# Altium schematic sheet Simple Sensor Board.SchDoc
size A4; SheetNumber: 1; SheetTotal: 1
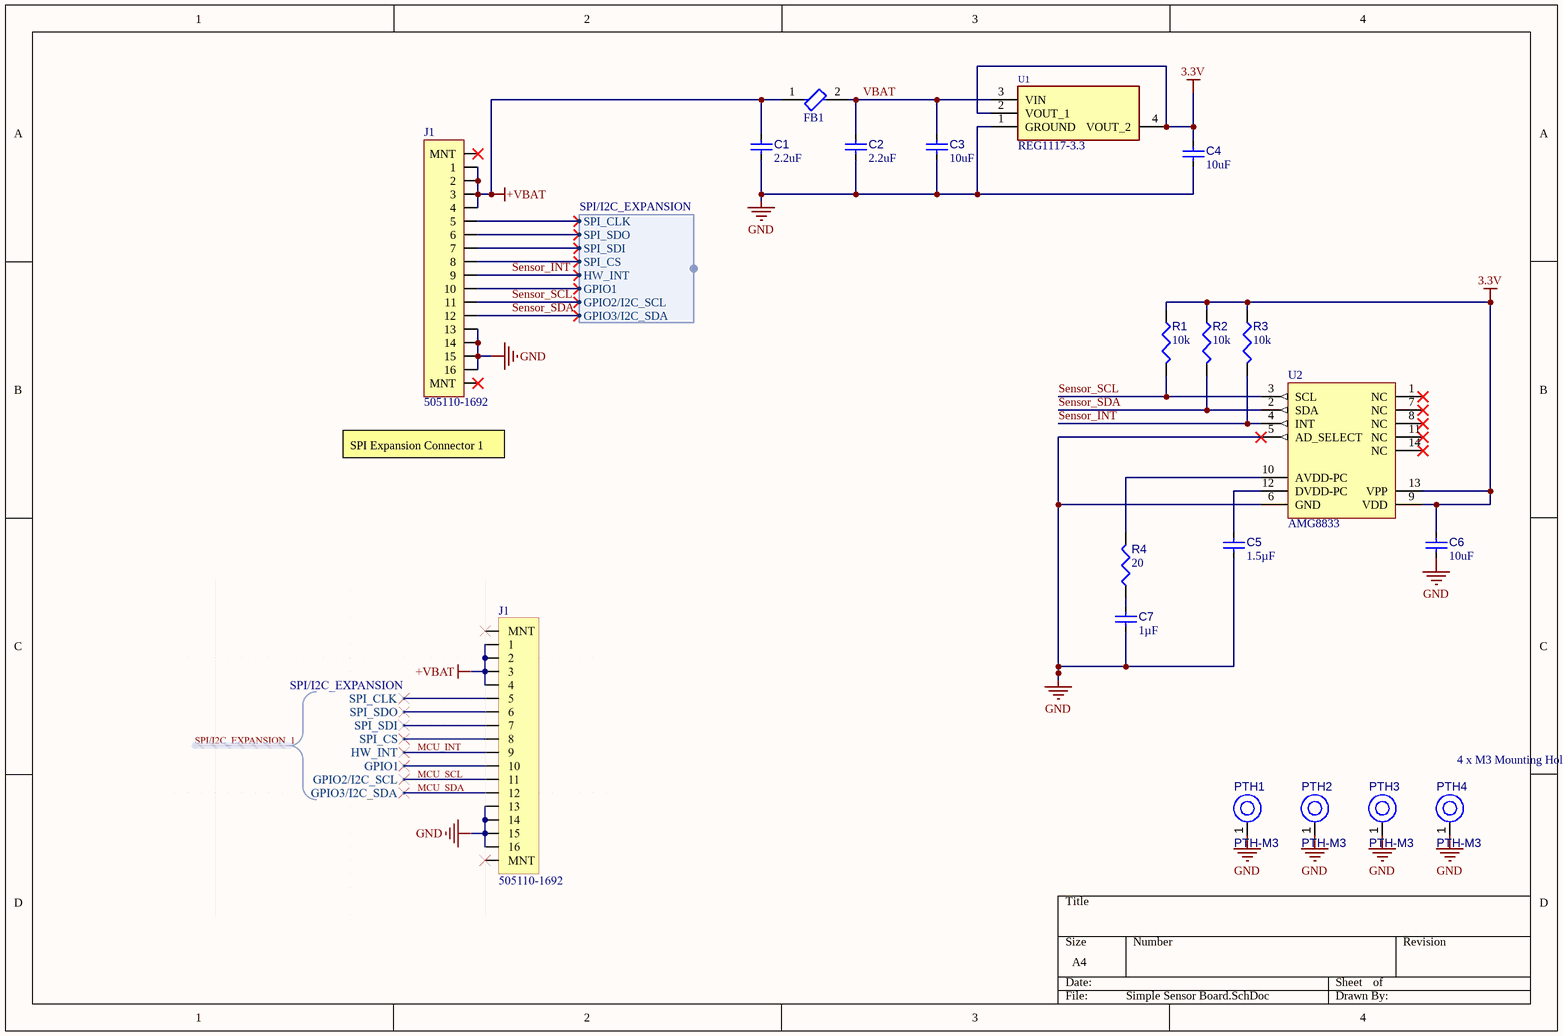
[diagram p0: Simple Sensor Board.SchDoc]

## Parts
C1  value 2.2uF  [CAPC2013X95X50ML10T25]  (hidden comment: Capacitor 2.2 uF +/-10% 16 V 0805)
C2  value 2.2uF  [CAPC2013X95X50ML10T25]  (hidden comment: Capacitor 2.2 uF +/-10% 16 V 0805)
C3  value 10uF  [CAPC3216X180X50ML20T25]  (hidden comment: Capacitor 10 uF +/- 10% 10 V 1206)
C4  value 10uF  [CAPC3216X180X50ML20T25]  (hidden comment: Capacitor 10 uF +/- 10% 10 V 1206)
C5  value 1.5µF  [CAPC1608X90X40ML10T20]  (hidden comment: Capacitor 1.5 uF +/- 10% 25 V 0603)
C6  value 10uF  [CAPC3216X180X50ML20T25]  (hidden comment: Capacitor 10 uF +/- 10% 10 V 1206)
C7  value 1µF  [CAPC1608X90X40ML10T20]  (hidden comment: Capacitor 1 uF +/- 10% 25 V 0603)
FB1  BLM15AX601SZ1D  [FP-BLM15-0_05-IPC_A]  (value not drawn)
J1  505110-1692  [FP-505110-1692-MFG]
PTH1  PTH-M3  [PTH-M3]
PTH2  PTH-M3  [PTH-M3]
PTH3  PTH-M3  [PTH-M3]
PTH4  PTH-M3  [PTH-M3]
R1  value 10k  [RESC1608X55X25ML10T15]  (hidden comment: Resistor 10k +/-1% 0603 100 mW)
R2  value 10k  [RESC1608X55X25ML10T15]  (hidden comment: Resistor 10k +/-1% 0603 100 mW)
R3  value 10k  [RESC1608X55X25ML10T15]  (hidden comment: Resistor 10k +/-1% 0603 100 mW)
R4  value 20  [RESC1608X55X25ML10T15]  (hidden comment: Resistor 20 +/-1% 0603 100 mW)
U1  REG1117-3.3  [SOT230P700X180-4N]
U2  AMG8833  [PNSC-AMG8833_V]

## Harnesses
SPI/I2C_EXPANSION: SPI_CLK, SPI_SDO, SPI_SDI, SPI_CS, HW_INT, GPIO1, GPIO2/I2C_SCL, GPIO3/I2C_SDA

## Nets
3.3V: C4.2 C6.2 R1.1 R2.1 R3.1 U1.2(VOUT_1) U1.4(VOUT_2) U2.9(VDD) U2.13(VPP)
+VBAT: C1.2 FB1.1 J1.1 J1.2 J1.3 J1.4
GND: C1.1 C2.1 C3.1 C4.1 C5.1 C6.1 C7.1 J1.13 J1.14 J1.15 J1.16 PTH1.1(H1) PTH2.1(H1) PTH3.1(H1) PTH4.1(H1) U1.1(GROUND) U2.5(AD_SELECT) U2.6(GND)
Sensor_INT: J1.9 R3.2 U2.4(INT) ; harness SPI/I2C_EXPANSION.HW_INT
Sensor_SCL: J1.11 R1.2 U2.3(SCL) ; harness SPI/I2C_EXPANSION.GPIO2/I2C_SCL
Sensor_SDA: J1.12 R2.2 U2.2(SDA) ; harness SPI/I2C_EXPANSION.GPIO3/I2C_SDA
VBAT: C2.2 C3.2 FB1.2 U1.3(VIN)
NetC5_2: C5.2 U2.12(DVDD-PC)
NetC7_2: C7.2 R4.1
NetJ1_5: J1.5 ; harness SPI/I2C_EXPANSION.SPI_CLK
NetJ1_6: J1.6 ; harness SPI/I2C_EXPANSION.SPI_SDO
NetJ1_7: J1.7 ; harness SPI/I2C_EXPANSION.SPI_SDI
NetJ1_8: J1.8 ; harness SPI/I2C_EXPANSION.SPI_CS
NetJ1_10: J1.10 ; harness SPI/I2C_EXPANSION.GPIO1
NetR4_2: R4.2 U2.10(AVDD-PC)

Not connected (* = marked no-connect by the designer): J1 17(MNT)* 18(MNT)*; U2 1(NC)* 7(NC)* 8(NC)* 11(NC)* 14(NC)*

## Notes on the sheet
- (near J1) SPI Expansion Connector 1
- 4 x M3 Mounting Holes, 32.5x32.5 mm Pattern

## Library data of the parts
C1 C2 = CMP-001-00083-3: Chip Capacitor, 2.2 uF, +/- 10%, 16 V, 0805 (2012 Metric); Voltage Rating: 16V; Capacitor Type: Ceramic; Mounting Technology: SM; Tolerance: 10%; Case/Package: 0805; Min Operating Temperature: -55°C; RoHS Compliant: Yes; Max Operating Temperature: 125°C; Pins: 2
C3 C4 C6 = CMP-001-00086-2: Chip Capacitor, 10 uF, +/- 10%, 10 V, 1206 (3216 Metric); Voltage Rating: 10V; Capacitor Type: Ceramic; Mounting Technology: SM; RoHS Compliant: Yes; Min Operating Temperature: -55°C; Case/Package: 1206; Max Operating Temperature: 125°C; Tolerance: 10%; Pins: 2
C5 = CMP-001-00089-1: Chip Capacitor, 1.5 uF, +/-10%, 25 V, 0603(1608 Metric); Capacitor Type: Ceramic; Voltage Rating: 25V; Tolerance: 10%; Min Operating Temperature: -55°C; Pins: 2; Case/Package: 0603; Mounting Technology: SM; RoHS Compliant: True; Max Operating Temperature: 125°C
C7 = CMP-001-00010-12: Chip Capacitor, 1 uF, +/-10%, 25 V, 0603(1608 Metric); Capacitor Type: Ceramic; Voltage Rating: 25V; Mounting Technology: SM; Tolerance: 10%; Case/Package: 0603; Max Operating Temperature: 125°C; Min Operating Temperature: -55°C; RoHS Compliant: True; Pins: 2
FB1 = CMP-006-00022-1: Ferrite Beads Multi-Layer 600Ohm 25% 100MHz 0.5A 0.34Ohm DCR 0402 Automotive T/R
J1 = CMP-002-00072-15: Conn FFC/FPC Connector SKT 16 POS 0.5mm Solder RA SMD Easy-On™ T/R
PTH1-PTH4 = CMP-00028-00010-1: M3 Plated Through Hole, 8mm Diameter Pad; Pins: 1
R1-R3 = CMP-009-00017-6: Chip Resistor, 10 KOhm, +/- 1%, 01 W, -55 to 155 degC, 0603 (1608 Metric); Voltage Rating: 50V; Power: 100mW; Min Operating Temperature: -55°C; RoHS Compliant: True; Pins: 2; Mounting Technology: SM; Tolerance: 1%; Case/Package: 0603; Max Operating Temperature: 155°C
R4 = CMP-009-00187-1: Chip Resistor, 20 Ohm, +/- 1%, 0.1 W, -55 to 155 degC, 0603 (1608 Metric); Power: 100mW; Pins: 2; RoHS Compliant: True; Tolerance: 1%; Mounting Technology: SM; Max Operating Temperature: 155°C; Case/Package: 0603; Min Operating Temperature: -55°C
U1 = REG1117-3.3: Integrated Circuit; Manufacturer_Name: Texas Instruments; Datasheet Link: https://datasheet.datasheetarchive.com/originals/distributors/Datasheets-SFU2/DSASFU100026654.pdf; Height: 1.8mm; Mouser2 Part Number: 595-REG1117-3.3; Mouser2 Price/Stock: https://www.mouser.com/Search/Refine.aspx?Keyword=595-REG1117-3.3; Manufacturer_Part_Number: REG1117-3.3
U2 = CMP-010-00026-2: Infrared Array Sensor, Grid-EYE, 8 Pixels H, 8 Pixels V, 3.3V, High Gain Type